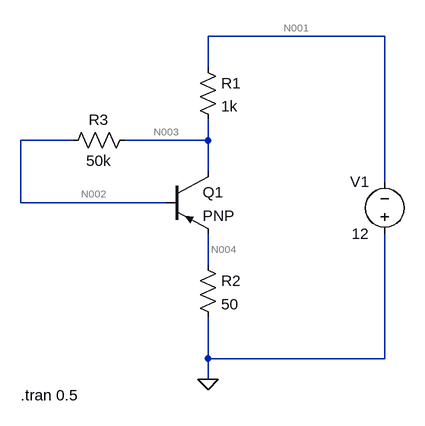
[diagram p0: schematic 3-1-2.asc]
3-1-2.asc, the LTspice schematic file:
Version 4.1
SHEET 1 880 680
WIRE 480 -96 208 -96
WIRE 208 -48 208 -96
WIRE 0 64 -80 64
WIRE 208 64 208 32
WIRE 208 64 80 64
WIRE 208 112 208 64
WIRE 480 128 480 -96
WIRE -80 160 -80 64
WIRE 144 160 -80 160
WIRE 208 256 208 208
WIRE 208 400 208 336
WIRE 480 400 480 208
WIRE 480 400 208 400
WIRE 208 432 208 400
FLAG 208 432 0
SYMBOL pnp 144 112 R0
SYMATTR InstName Q1
SYMBOL res 192 -64 R0
SYMATTR InstName R1
SYMATTR Value 1k
SYMBOL res 192 240 R0
SYMATTR InstName R2
SYMATTR Value 50
SYMBOL res 96 48 R90
WINDOW 0 0 56 VBottom 2
WINDOW 3 32 56 VTop 2
SYMATTR InstName R3
SYMATTR Value 50k
SYMBOL voltage 480 224 R180
WINDOW 0 24 96 Left 2
WINDOW 3 24 16 Left 2
WINDOW 123 0 0 Left 0
WINDOW 39 0 0 Left 0
SYMATTR InstName V1
SYMATTR Value 12
TEXT -80 456 Left 2 !.tran 0.5

The netlist it stands for:
* 3-1-2.asc
Q1 N003 N002 N004 0 PNP
R1 N001 N003 1k
R2 N004 0 50
R3 N003 N002 50k
V1 0 N001 12
.model NPN NPN
.model PNP PNP
.lib standard.bjt
.tran 0.5
.backanno
.end

* Results of the author's LTspice run, read from the files saved beside the schematic
* Operating Point, zero values left out:
*   V(n002) = -1.187 V
*   V(n001) = -12 V
*   V(n003) = -4.767 V
*   V(n004) = -361.6 mV
*   Ic(Q1) = -7.161 mA
*   Ib(Q1) = -71.61 µA
*   Ie(Q1) = 7.233 mA
*   I(R2) = -7.233 mA
*   I(V1) = -7.233 mA
*   I(R3) = -71.61 µA
*   I(R1) = -7.233 mA